# EAGLE design w65c265sxb_controller_rev2 (EAGLE 9.6.2)
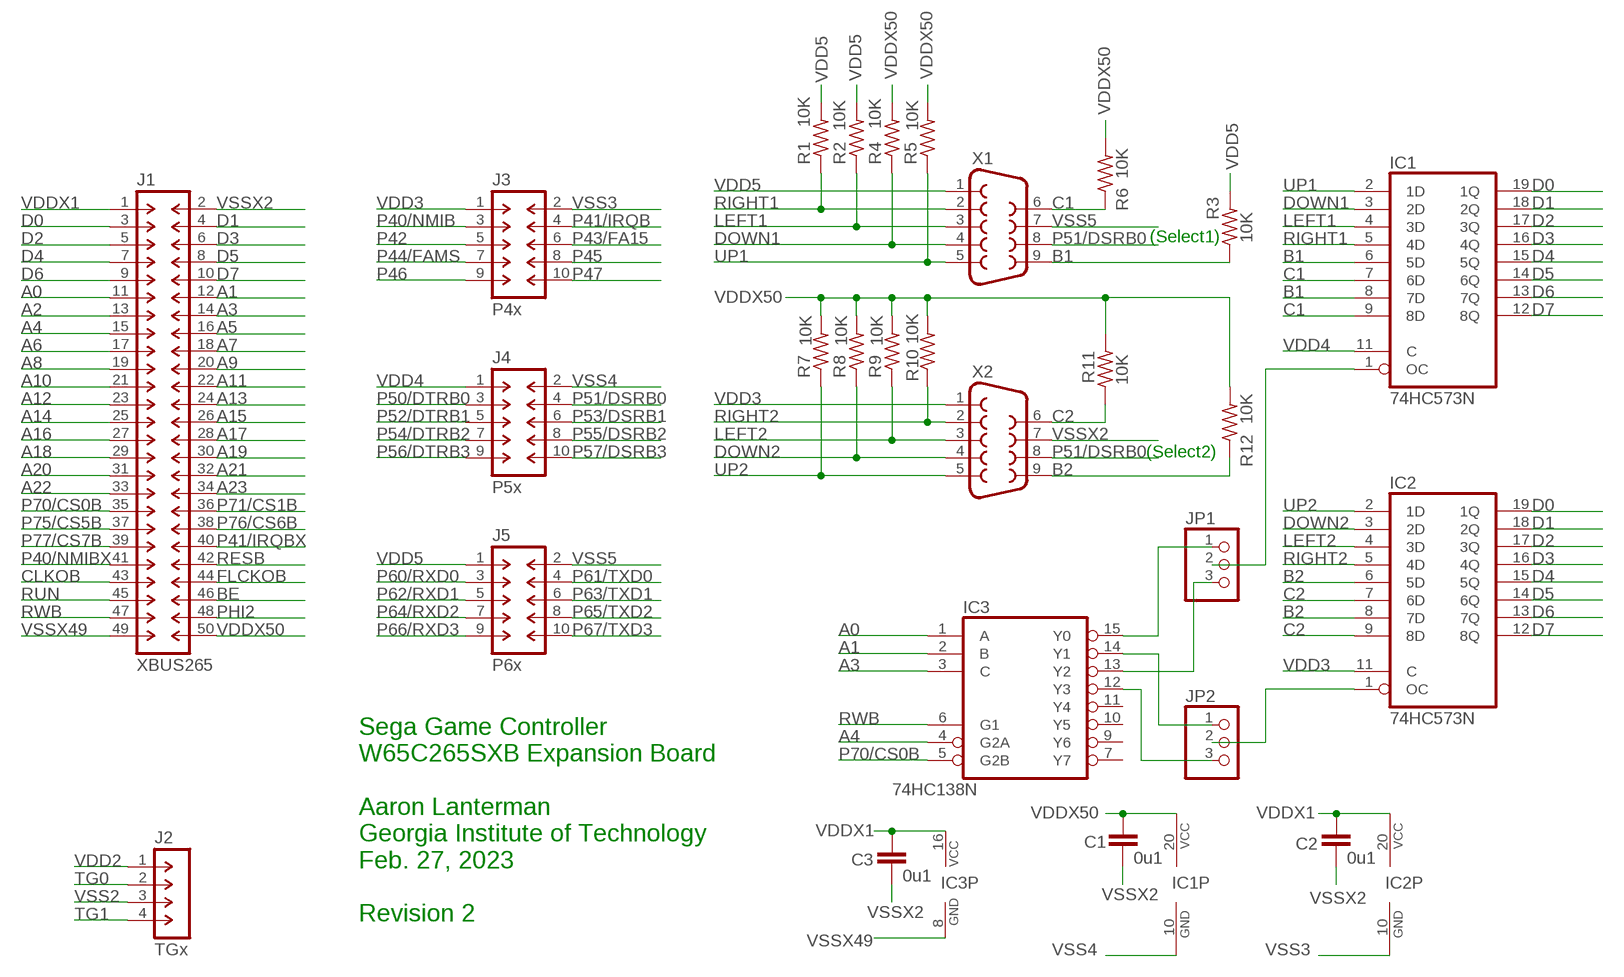
[diagram p0: schematic, sheet 1]

## Parts
C1  0u1  C-EU050-025X075-AARON  [C050-025X075-AARON]
C2  0u1  C-EU050-025X075-AARON  [C050-025X075-AARON]
C3  0u1  C-EU050-025X075-AARON  [C050-025X075-AARON]
IC1  74HC573N  [DIL20]
IC2  74HC573N  [DIL20]
IC3  74HC138N  [DIL16]
J1  XBUS265  M-2X25-DIL-100  [DIL-100-2X25]
J2  TGx  M-1X04-SIP-100-40  [SIP-100-04-40]
J3  P4x  M-2X05-DIL-100  [DIL-100-2X05]
J4  P5x  M-2X05-DIL-100  [DIL-100-2X05]
J5  P6x  M-2X05-DIL-100  [DIL-100-2X05]
JP1  PINHD-1X3  [1X03]
JP2  PINHD-1X3  [1X03]
R1  10K  R-US_0207/10  [0207/10]
R2  10K  R-US_0207/10  [0207/10]
R3  10K  R-US_0207/10  [0207/10]
R4  10K  R-US_0207/10  [0207/10]
R5  10K  R-US_0207/10  [0207/10]
R6  10K  R-US_0207/10  [0207/10]
R7  10K  R-US_0207/10  [0207/10]
R8  10K  R-US_0207/10  [0207/10]
R9  10K  R-US_0207/10  [0207/10]
R10  10K  R-US_0207/10  [0207/10]
R11  10K  R-US_0207/10  [0207/10]
R12  10K  R-US_0207/10  [0207/10]
X1  F09HP  [F09HP]
X2  F09HP  [F09HP]

## Nets
A0: IC3.1(A) J1.11
A1: IC3.2(B) J1.12
A2: J1.13
A3: IC3.3(C) J1.14
A4: IC3.4(G2A) J1.15
A5: J1.16
A6: J1.17
A7: J1.18
A8: J1.19
A9: J1.20
A10: J1.21
A11: J1.22
A12: J1.23
A13: J1.24
A14: J1.25
A15: J1.26
A16: J1.27
A17: J1.28
A18: J1.29
A19: J1.30
A20: J1.31
A21: J1.32
A22: J1.33
A23: J1.34
B1: IC1.6(5D) IC1.8(7D) R3.1 X1.9
B2: IC2.6(5D) IC2.8(7D) R12.1 X2.9
BE: J1.46
C1: IC1.7(6D) IC1.9(8D) R6.1 X1.6
C2: IC2.7(6D) IC2.9(8D) R11.1 X2.6
CLKOB: J1.43
D0: IC1.19(1Q) IC2.19(1Q) J1.3
D1: IC1.18(2Q) IC2.18(2Q) J1.4
D2: IC1.17(3Q) IC2.17(3Q) J1.5
D3: IC1.16(4Q) IC2.16(4Q) J1.6
D4: IC1.15(5Q) IC2.15(5Q) J1.7
D5: IC1.14(6Q) IC2.14(6Q) J1.8
D6: IC1.13(7Q) IC2.13(7Q) J1.9
D7: IC1.12(8Q) IC2.12(8Q) J1.10
DOWN1: IC1.3(2D) R4.1 X1.4
DOWN2: IC2.3(2D) R8.1 X2.4
FLCKOB: J1.44
LEFT1: IC1.4(3D) R2.1 X1.3
LEFT2: IC2.4(3D) R9.1 X2.3
N$8: IC3.15(Y0) JP1.1
N$9: IC3.13(Y2) JP1.3
N$10: IC1.1(OC) JP1.2
N$11: IC3.14(Y1) JP2.1
N$12: IC3.12(Y3) JP2.3
N$13: IC2.1(OC) JP2.2
P40/NMIB: J3.3
P40/NMIBX: J1.41
P41/IRQB: J3.4
P41/IRQBX: J1.40
P42: J3.5
P43/FA15: J3.6
P44/FAMS: J3.7
P45: J3.8
P46: J3.9
P47: J3.10
P50/DTRB0: J4.3
P51/DSRB0: J4.4 X1.8 X2.8
P52/DTRB1: J4.5
P53/DSRB1: J4.6
P54/DTRB2: J4.7
P55/DSRB2: J4.8
P56/DTRB3: J4.9
P57/DSRB3: J4.10
P60/RXD0: J5.3
P61/TXD0: J5.4
P62/RXD1: J5.5
P63/TXD1: J5.6
P64/RXD2: J5.7
P65/TXD2: J5.8
P66/RXD3: J5.9
P67/TXD3: J5.10
P70/CS0B: IC3.5(G2B) J1.35
P71/CS1B: J1.36
P75/CS5B: J1.37
P76/CS6B: J1.38
P77/CS7B: J1.39
PHI2: J1.48
RESB: J1.42
RIGHT1: IC1.5(4D) R1.1 X1.2
RIGHT2: IC2.5(4D) R10.1 X2.2
RUN: J1.45
RWB: IC3.6(G1) J1.47
TG0: J2.2
TG1: J2.4
UP1: IC1.2(1D) R5.1 X1.5
UP2: IC2.2(1D) R7.1 X2.5
VDD2: J2.1
VDD3: IC2.11(C) J3.1 X2.1
VDD4: IC1.11(C) J4.1
VDD5: J5.1 R1.2 R2.2 R3.2 X1.1
VDDX1: C2.1 C3.1 IC2.20(VCC) IC3.16(VCC) J1.1
VDDX50: C1.1 IC1.20(VCC) J1.50 R4.2 R5.2 R6.2 R7.2 R8.2 R9.2 R10.2 R11.2 R12.2
VSS2: J2.3
VSS3: IC2.10(GND) J3.2
VSS4: IC1.10(GND) J4.2
VSS5: J5.2 X1.7
VSSX2: C1.2 C2.2 C3.2 J1.2 X2.7
VSSX49: IC3.8(GND) J1.49
Unconnected: IC3.7(Y7) IC3.9(Y6) IC3.10(Y5) IC3.11(Y4)

## Notes on the sheet
- (Select1)
- (Select2)
- Sega Game Controller
  W65C265SXB Expansion Board
  
  Aaron Lanterman
  Georgia Institute of Technology
  Feb. 27, 2023
  
  Revision 2

## Library data of the parts
C1-C3 = aaroncaps:C-EU: CAPACITOR, European symbol
IC1 IC2 = 74xx-us:74*573: 8-bit D latch BUS DRIVER
IC3 = 74xx-eu:74*138: 3-line to 8-line DECODER/DEMULTIPLEXER
J1 = con-headers-jp:M-2X25-: MALE HEADER
J2 = con-headers-jp:M-1X04-: MALE HEADER
J3-J5 = con-headers-jp:M-2X05-: MALE HEADER
JP1 JP2 = pinhead:PINHD-1X3: PIN HEADER
R1-R12 = rcl:R-US_: RESISTOR, American symbol; SPICEPREFIX: R
X1 X2 = con-subd:F09: SUB-D; OC_FARNELL: unknown; OC_NEWARK: unknown

## Board
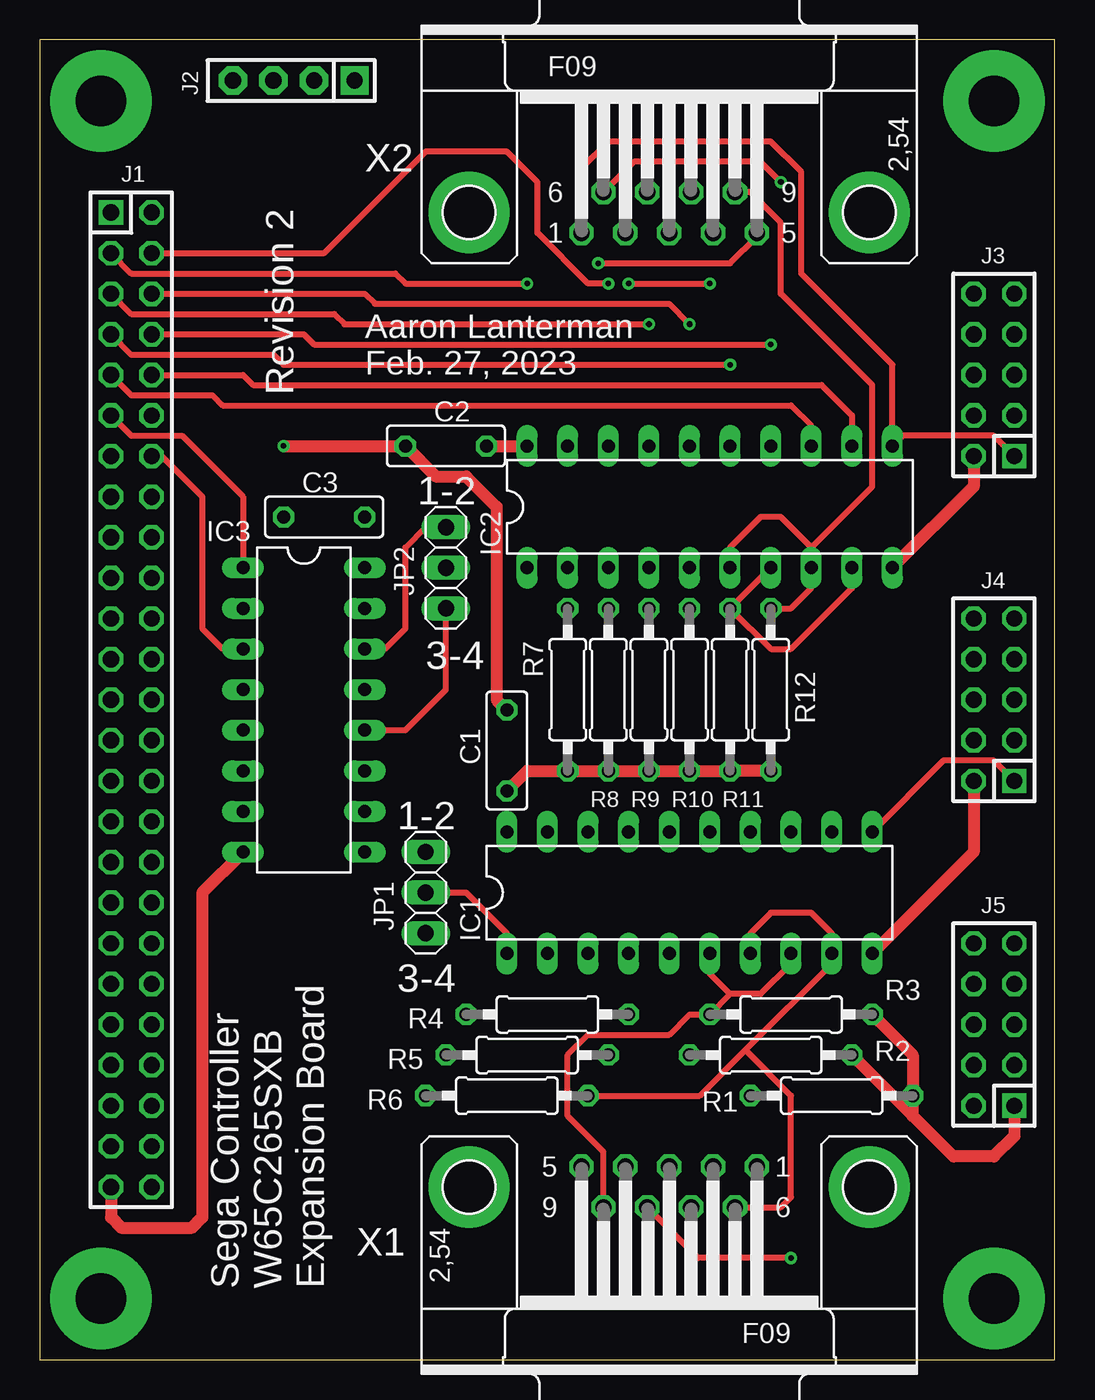
[diagram p1: board, top side]
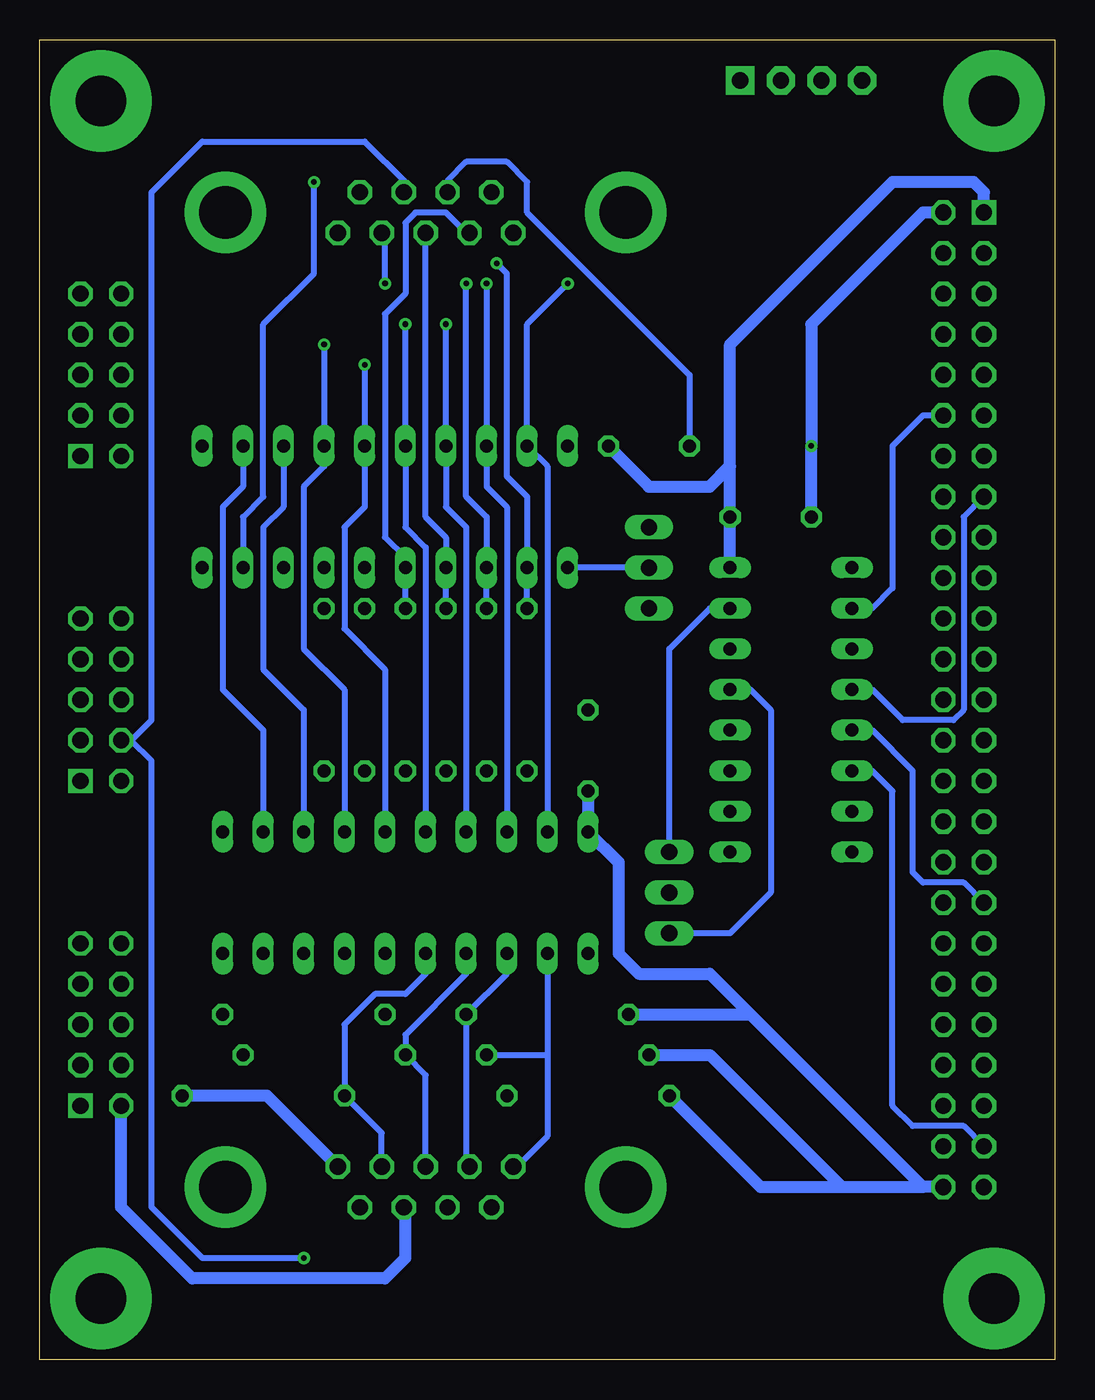
[diagram p2: board, bottom side, seen from below]

Size 63.5 x 82.55 mm. Coordinates in mm from the lower left corner, seen from the top.
Outline: 0,0 63.5,0 63.5,82.55 0,82.55 0,0
Copper layers (1*16): Top 0.035mm / dielectric 1.5mm / Bottom 0.035mm
Design rules "default": minimum track width 6mil, minimum drill 0.35mm, track to track 6mil, track to pad 6mil, pad to pad 6mil, via to via 6mil, smd to smd 6mil, copper to edge 40mil, drill to drill 6mil, minimum pad ring 10mil, minimum via ring 8mil, stop-mask expansion 4mil, vias tented up to drill 0mil, thermal gap 10mil

### Footprints (pad centres in the part's own frame; a part is rotated, then mirrored left to right if it is on the bottom)
C050-025X075-AARON = drill 0.813 octagon: 1 -2.54,0; 2 2.54,0
DIL20 = drill 0.813 long: 1 -11.43,-3.81; 2 -8.89,-3.81; 3 -6.35,-3.81; 4 -3.81,-3.81; 5 -1.27,-3.81; 6 1.27,-3.81; 7 3.81,-3.81; 8 6.35,-3.81; 9 8.89,-3.81; 10 11.43,-3.81; 11 11.43,3.81; 12 8.89,3.81; 13 6.35,3.81; 14 3.81,3.81; 15 1.27,3.81; 16 -1.27,3.81; 17 -3.81,3.81; 18 -6.35,3.81; 19 -8.89,3.81; 20 -11.43,3.81
DIL16 = drill 0.813 long: 1 -8.89,-3.81; 2 -6.35,-3.81; 3 -3.81,-3.81; 4 -1.27,-3.81; 5 1.27,-3.81; 6 3.81,-3.81; 7 6.35,-3.81; 8 8.89,-3.81; 9 8.89,3.81; 10 6.35,3.81; 11 3.81,3.81; 12 1.27,3.81; 13 -1.27,3.81; 14 -3.81,3.81; 15 -6.35,3.81; 16 -8.89,3.81
DIL-100-2X25 = drill 1.016 square: 1 -30.48,-1.27 | drill 1.016 octagon: 2 -30.48,1.27; 3 -27.94,-1.27; 4 -27.94,1.27; 5 -25.4,-1.27; 6 -25.4,1.27; 7 -22.86,-1.27; 8 -22.86,1.27; 9 -20.32,-1.27; 10 -20.32,1.27; 11 -17.78,-1.27; 12 -17.78,1.27; 13 -15.24,-1.27; 14 -15.24,1.27; 15 -12.7,-1.27; 16 -12.7,1.27; 17 -10.16,-1.27; 18 -10.16,1.27; 19 -7.62,-1.27; 20 -7.62,1.27; 21 -5.08,-1.27; 22 -5.08,1.27; 23 -2.54,-1.27; 24 -2.54,1.27; 25 0,-1.27; 26 0,1.27; 27 2.54,-1.27; 28 2.54,1.27; 29 5.08,-1.27; 30 5.08,1.27; 31 7.62,-1.27; 32 7.62,1.27; 33 10.16,-1.27; 34 10.16,1.27; 35 12.7,-1.27; 36 12.7,1.27; 37 15.24,-1.27; 38 15.24,1.27; 39 17.78,-1.27; 40 17.78,1.27; 41 20.32,-1.27; 42 20.32,1.27; 43 22.86,-1.27; 44 22.86,1.27; 45 25.4,-1.27; 46 25.4,1.27; 47 27.94,-1.27; 48 27.94,1.27; 49 30.48,-1.27; 50 30.48,1.27
SIP-100-04-40 = drill 1.016 pad 1.778 square: 1 -3.81,0 | drill 1.016 pad 1.778 octagon: 2 -1.27,0; 3 1.27,0; 4 3.81,0
DIL-100-2X05 = drill 1.016 square: 1 -5.08,-1.27 | drill 1.016 octagon: 2 -5.08,1.27; 3 -2.54,-1.27; 4 -2.54,1.27; 5 0,-1.27; 6 0,1.27; 7 2.54,-1.27; 8 2.54,1.27; 9 5.08,-1.27; 10 5.08,1.27
1X03 = drill 1.016 long: 1 -2.54,0; 2 0,0; 3 2.54,0
0207/10 = drill 0.813 octagon: 1 -5.08,0; 2 5.08,0
F09HP = drill 1.016 octagon: 1 -5.486,-1.27; 2 -2.743,-1.27; 3 0,-1.27; 4 2.743,-1.27; 5 5.486,-1.27; 6 -4.115,1.27; 7 -1.372,1.27; 8 1.372,1.27; 9 4.115,1.27 | drill 3.302 pad 5.08: G1 -12.522,0; G2 12.522,0

### Placement (x,y rotation side)
C1  29.21,38.1 90 top
C2  25.4,57.15 180 top
C3  17.78,52.7 180 top
IC1  40.64,29.21 0 top
IC2  41.91,53.34 0 top
IC3  16.51,40.64 270 top
J1  5.71,41.27 270 top
J2  15.88,80.01 180 top
J3  59.69,61.59 90 top
J4  59.69,41.27 90 top
J5  59.69,20.95 90 top
JP1  24.13,29.21 270 top
JP2  25.4,49.53 270 top
R1  49.53,16.51 0 top
R2  45.72,19.05 0 top
R3  46.99,21.59 0 top
R4  31.75,21.59 180 top
R5  30.48,19.05 180 top
R6  29.21,16.51 180 top
R7  33.02,41.91 270 top
R8  35.56,41.91 270 top
R9  38.1,41.91 270 top
R10  40.64,41.91 270 top
R11  43.18,41.91 270 top
R12  45.72,41.91 270 top
X1  39.37,10.79 180 top
X2  39.37,71.75 0 top

### Tracks (layer width: path | path; a pad name or v marks a point on that pad's centre or on a via)
A0
  Top 0.381: J1.11 5.71,57.78 8.89,57.78 12.7,53.98 IC3.1
A1
  Bottom 0.381: J1.12 8.26,59.05 10.16,57.15 10.16,48.26 11.43,46.99 IC3.2
A3
  Top 0.381: J1.14 7.62,56.52 10.16,53.98 10.16,45.72 11.43,44.45 IC3.3
A4
  Bottom 0.381: J1.15 5.71,52.7 5.71,40.64 6.35,40.01 9.53,40.01 11.43,41.91 IC3.4
B1
  Top 0.381: 43.18,22.86 45.09,22.86 46.99,24.77 IC1.8 | 43.18,22.86 41.91,24.13 IC1.6 | X1.9 35.26,13.01 33.02,15.24 33.02,19.05 34.29,20.32 39.37,20.32 40.64,21.59 R3.1 43.18,22.86
B2
  Top 0.381: 48.26,50.8 52.07,54.61 52.07,60.96 46.35,66.67 46.35,71.12 44.45,73.03 X2.9 | 48.26,50.8 IC2.8 48.26,48.26 46.99,46.99 R12.1 | 48.26,50.8 46.35,52.7 45.09,52.7 43.18,50.8 IC2.6
C1
  Top 0.381: 44.13,19.37 41.27,16.51 R6.1 | 44.13,19.37 49.53,24.77 IC1.9 49.53,26.67 48.26,27.94 45.72,27.94 44.45,26.67 IC1.7 | 44.13,19.37 46.99,16.51 46.99,10.16 46.35,9.53 X1.6
C2  (via drill 0.35)
  Top 0.381: IC2.9 50.8,48.26 46.99,44.45 45.72,44.45 R11.1 IC2.7 | v46.35,73.66 45.09,74.93 37.16,74.93 X2.6
  Bottom 0.381: IC2.9 50.8,52.7 49.53,53.98 49.53,64.77 46.35,67.94 v46.35,73.66
D0  (via drill 0.35)
  Top 0.381: J1.3 5.71,67.94 22.23,67.94 22.86,67.31 v30.48,67.31
  Bottom 0.381: IC1.19 31.75,55.88 IC2.19 33.02,64.77 v30.48,67.31
D1  (via drill 0.35)
  Top 0.381: J1.4 17.78,69.22 24.13,75.56 29.21,75.56 31.11,73.66 31.11,70.48 34.29,67.31 v35.56,67.31
  Bottom 0.381: IC1.18 34.29,53.34 35.56,54.61 IC2.18 v35.56,67.31
D2  (via drill 0.35)
  Top 0.381: J1.5 5.71,65.41 18.41,65.41 19.05,64.77 v38.1,64.77
  Bottom 0.381: IC1.17 36.83,52.07 38.1,53.34 IC2.17 v38.1,64.77
D3  (via drill 0.35)
  Top 0.381: J1.6 20.32,66.67 20.95,66.04 39.37,66.04 v40.64,64.77
  Bottom 0.381: IC1.16 39.37,50.8 40.64,52.07 IC2.16 v40.64,64.77
D4  (via drill 0.35)
  Top 0.381: J1.7 5.71,62.87 14.61,62.87 15.24,62.23 v43.18,62.23
  Bottom 0.381: IC1.15 41.91,43.18 44.45,45.72 44.45,52.07 43.18,53.34 IC2.15 v43.18,62.23
D5  (via drill 0.35)
  Top 0.381: v45.72,63.5 17.14,63.5 16.51,64.14 J1.8
  Bottom 0.381: IC1.14 44.45,41.91 46.99,44.45 46.99,54.61 45.72,55.88 IC2.14 v45.72,63.5
D6
  Top 0.381: J1.9 5.71,60.33 10.79,60.33 11.43,59.69 46.99,59.69 48.26,58.42 IC2.13
  Bottom 0.381: IC2.13 48.26,53.34 49.53,52.07 49.53,43.18 46.99,40.64 IC1.13
D7
  Top 0.381: J1.10 12.7,61.59 13.34,60.96 48.9,60.96 50.8,59.05 IC2.12
  Bottom 0.381: IC2.12 50.8,54.61 52.07,53.34 52.07,41.91 49.53,39.37 IC1.12
DOWN1
  Bottom 0.381: IC1.3 34.29,24.13 R4.1 36.83,12.27 X1.4
DOWN2  (via drill 0.35)
  Top 0.381: v36.83,67.31 v41.91,67.31
  Bottom 0.381: v41.91,67.31 41.91,70.28 X2.4 | v36.83,67.31 36.83,53.98 35.56,52.7 IC2.3 R8.1
LEFT1
  Bottom 0.381: IC1.4 36.83,24.13 40.64,20.32 R2.1 39.37,17.78 X1.3
LEFT2
  Bottom 0.381: X2.3 39.37,52.7 38.1,51.44 IC2.4 R9.1
N$1  (via drill 3.17 pad 6.35)
  other vias: 3.81,3.81
N$2  (via drill 3.17 pad 6.35)
  other vias: 59.69,3.81
N$3  (via drill 3.17 pad 6.35)
  other vias: 59.69,78.74
N$4  (via drill 3.17 pad 6.35)
  other vias: 3.81,78.74
N$8
  Bottom 0.381: 24.13,44.45 21.59,46.99 IC3.15 | 24.13,44.45 JP1.1 24.13,44.45
N$9
  Bottom 0.381: IC3.13 19.05,41.91 17.78,40.64 17.78,29.21 20.32,26.67 JP1.3
N$10
  Top 0.381: IC1.1 29.21,26.67 26.67,29.21 JP1.2
N$11
  Top 0.381: IC3.14 21.59,44.45 22.86,45.72 22.86,50.8 24.13,52.07 JP2.1
N$12
  Top 0.381: IC3.12 22.86,39.37 25.4,41.91 JP2.3
N$13
  Bottom 0.381: JP2.2 IC2.1
P51/DSRB0  (via drill 0.35)
  Top 0.381: v46.99,6.35 41.17,6.35 X1.8
  Bottom 0.381: 57.78,38.73 56.52,40.01 56.52,73.03 53.34,76.2 43.18,76.2 40.64,73.66 40.64,73.13 X2.8 | J4.4 57.78,38.73 | v46.99,6.35 53.34,6.35 56.52,9.53 56.52,37.47 57.78,38.73
P70/CS0B
  Bottom 0.381: IC3.5 11.43,39.37 8.89,36.83 8.89,30.48 8.26,29.84 5.71,29.84 J1.35
RIGHT1
  Bottom 0.381: IC1.5 39.37,24.13 40.64,22.86 42.55,22.86 44.45,20.95 R1.1 42.11,14.17 X1.2
RIGHT2
  Bottom 0.381: X2.2 36.83,70.48 38.1,71.75 40.01,71.75 40.64,71.12 40.64,66.67 41.91,65.41 41.91,51.44 40.64,50.16 IC2.5 R10.1
RWB
  Bottom 0.381: IC3.6 11.43,36.83 10.16,35.56 10.16,15.88 8.89,14.61 5.71,14.61 J1.47
UP1
  Bottom 0.381: X1.5 33.66,12.06 31.75,13.97 31.75,19.05 | IC1.2 31.75,19.05 | R5.1 31.75,19.05
UP2  (via drill 0.35)
  Top 0.381: v34.92,68.58 43.18,68.58 44.86,70.26 X2.5
  Bottom 0.381: v34.92,68.58 34.29,67.94 34.29,55.24 33.02,53.98 IC2.2 R7.1
VDD3
  Top 0.381: J3.1 59.69,57.78 53.98,57.78 IC2.11 53.34,62.23 47.62,67.94 47.62,74.3 45.72,76.2 35.56,76.2 33.88,74.52 X2.1
VDD4
  Top 0.381: J4.1 59.69,37.47 56.52,37.47 IC1.11
VDD5
  Top 0.762: J5.1 60.96,13.97 59.69,12.7 57.15,12.7 54.61,15.24 | 54.61,15.24 R1.2 54.61,19.05 R3.2 | R2.2 54.61,15.24
  Bottom 0.762: X1.1 49.3,16.51 R1.2
VDDX1
  Top 0.762: C2.1 IC2.20
  Bottom 0.762: J1.1 4.45,73.03 5.08,73.66 10.16,73.66 20.32,63.5 20.32,55.88 | IC3.16 C3.1 20.32,55.88 | C2.1 25.4,54.61 21.59,54.61 20.32,55.88
VDDX50
  Top 0.762: R12.2 R11.2 R10.2 R9.2 R8.2 R7.2 30.48,36.83 C1.1
  Bottom 0.762: J1.50 8.26,10.79 | 19.05,21.59 21.59,24.13 26.04,24.13 27.3,25.4 27.3,31.11 IC1.20 C1.1 | 19.05,21.59 8.26,10.79 | R4.2 19.05,21.59 | 13.34,10.79 18.41,10.79 R6.2 | 13.34,10.79 8.26,10.79 | 13.34,10.79 21.59,19.05 R5.2
VSS3
  Top 0.762: J3.2 58.42,54.61 IC2.10
VSS4
  Top 0.762: J4.2 58.42,31.75 IC1.10
VSS5
  Bottom 0.762: J5.2 58.42,9.53 53.98,5.08 41.91,5.08 40.64,6.35 40.64,9.42 X1.7
VSSX2  (via drill 0.35)
  Top 0.762: v15.24,57.15 C2.2 24.77,55.24 26.67,55.24 28.57,53.34 28.57,41.27 C1.2
  Bottom 0.381: C2.2 22.86,61.59 33.02,71.75 33.02,73.66 34.29,74.93 36.83,74.93 38,73.76 X2.7
  Bottom 0.762: J1.2 8.26,71.75 15.24,64.77 v15.24,57.15 C3.2
VSSX49
  Top 0.762: J1.49 4.45,8.89 5.08,8.26 9.53,8.26 10.16,8.89 10.16,29.21 IC3.8

### Text on the board
tNames: Aaron Lanterman / Feb. 27, 2023 | Revision 2 | 1-2 | 3-4 | 1-2 | 3-4 | Sega Controller / W65C265SXB / Expansion Board